# EAGLE schematic schematic (EAGLE 7.5.0)
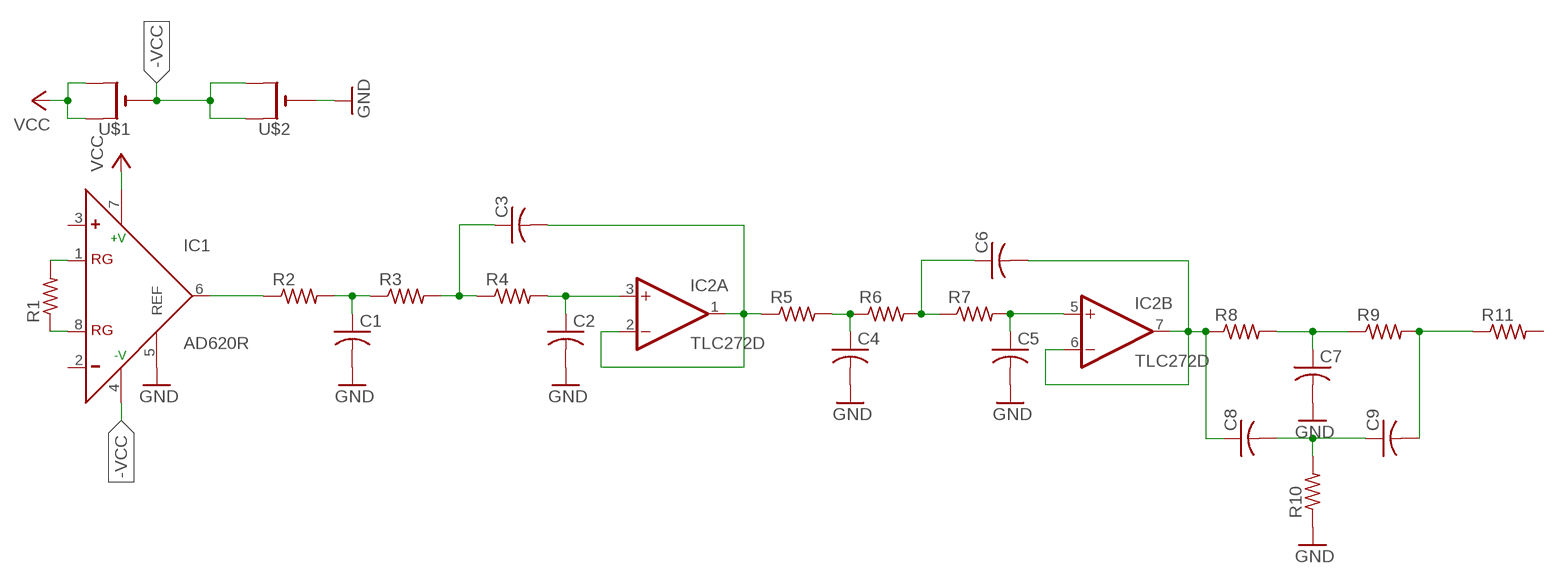
[diagram p0: schematic, sheet 1]

## Parts
C1  C-USC0805  [C0805]
C2  C-USC0805  [C0805]
C3  C-USC0805  [C0805]
C4  C-USC0805  [C0805]
C5  C-USC0805  [C0805]
C6  C-USC0805  [C0805]
C7  C-USC0805  [C0805]
C8  C-USC0805  [C0805]
C9  C-USC0805  [C0805]
IC1  AD620R  [SO8]
IC2  TLC272D  [SO08]
R1  R-US_R0805  [R0805]
R2  R-US_R0805  [R0805]
R3  R-US_R0805  [R0805]
R4  R-US_R0805  [R0805]
R5  R-US_R0805  [R0805]
R6  R-US_R0805  [R0805]
R7  R-US_R0805  [R0805]
R8  R-US_R0805  [R0805]
R9  R-US_R0805  [R0805]
R10  R-US_R0805  [R0805]
R11  R-US_R0805  [R0805]
U$1  CR1220SMT  [CR1220-SMD]
U$2  CR1220SMT  [CR1220-SMD]

## Nets
-VCC: IC1.4(-V) U$1.- U$2.+$1(+) U$2.+$2(+1)
GND: C1.2 C2.2 C4.2 C5.2 C7.2 IC1.5(REF) R10.1 U$2.-
N$1: C4.1 R5.2 R6.1
N$2: IC1.6(OUT) R2.1
N$3: C1.1 R2.2 R3.1
N$4: C3.1 R3.2 R4.1
N$5: C2.1 IC2.3(A:+IN) R4.2
N$6: C3.2 IC2.1(A:OUT) IC2.2(A:-IN) R5.1
N$7: C6.1 R6.2 R7.1
N$8: C5.1 IC2.5(B:+IN) R7.2
N$9: C6.2 C8.1 IC2.6(B:-IN) IC2.7(B:OUT) R8.1
N$10: C7.1 R8.2 R9.1
N$11: C9.2 R9.2 R11.1
N$12: C8.2 C9.1 R10.2
N$13: IC1.1(RG) R1.2
N$14: IC1.8(RG) R1.1
VCC: IC1.7(+V) U$1.+$1(+) U$1.+$2(+1)
Unconnected: IC1.2(-) IC1.3(+) R11.2

## Power pins joined to a net without a drawn wire
V+: IC2.8(P:V+)
V-: IC2.4(P:V-)

## Library data of the parts
C1-C9 = adafruit:C-US: CAPACITOR, American symbol
IC1 = analog-devices:AD620: Low Cost, Low Power, Instrumentation Amplifier Source: http://www.analog.com/UploadedFiles/Data_Sheets/37793330023930AD620_e.pdf; MPN: AD620AR; OC_FARNELL: 1464424; OC_NEWARK: 05F7109
IC2 = linear:TLC272: OP AMP
R1-R11 = adafruit:R-US_: RESISTOR, American symbol
U$1 U$2 = adafruit:CR1220: CR1216/CR1220/CR1225 12mm 3V lithium coin cell Great for battery packup. Both SMT and THM holders. Note the THM package has the ground pads on both sides of the PCB so that the masks are the same - this reduces the cost